# Altium schematic sheet CH340.schdoc
size 55 x 43 mm
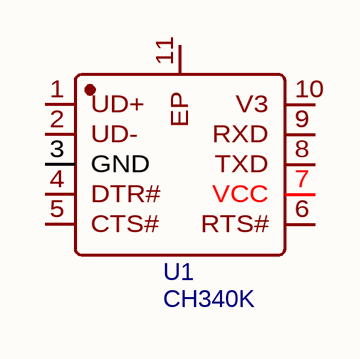
[diagram p0: CH340.schdoc]

## Parts
U1  CH340K  [ESOP-10_L4.9-W3.9-P1.00-LS6.2-BL-EP]

## Nets

Not connected (* = marked no-connect by the designer): U1 1(UD+) 2(UD-) 3(GND) 4(DTR#) 5(CTS#) 6(RTS#) 7(VCC) 8(TXD) 9(RXD) 10(V3) 11(EP)

## Library data of the parts
U1 = CH340K: BOM_Manufacturer: WCH(Jiangsu Qin Heng); Contributor: LCSC; BOM_Supplier: LCSC; BOM_Supplier Part: C968586; BOM_Manufacturer Part: CH340K; BOM_JLCPCB Part Class: Extended Part; spicePre: U; spiceSymbolName: CH340K